# EAGLE schematic rbg3 (EAGLE 7.5.0)
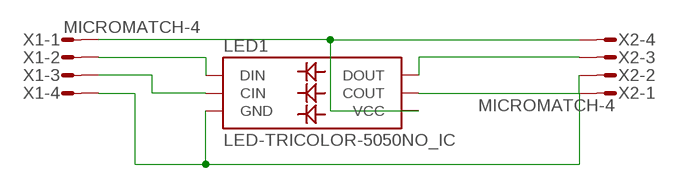
[diagram p0: schematic, sheet 1]

## Parts
LED1  LED-TRICOLOR-5050NO_IC  [LED-TRICOLOR-5050]
X1  MICROMATCH-4  [MICROMATCH-4]
X2  MICROMATCH-4  [MICROMATCH-4]

## Nets
N$1: LED1.4(VCC) X1.1 X2.4
N$2: LED1.1(DIN) X1.2
N$3: LED1.2(CIN) X1.3
N$4: LED1.3(GND) X1.4 X2.1
N$5: LED1.5(COUT) X2.2
N$6: LED1.6(DOUT) X2.3

## Library data of the parts
LED1 = SparkFun-LED:LED-TRICOLOR-5050
X1 X2 = con-amp-micromatch:MICROMATCH-4: MicroMaTch 4 7-215464-4 / 0-215464-4 Drawing Number C-215464 DDEController.pdf; MPN: 7-215464-4; OC_FARNELL: 3784629; OC_NEWARK: 19R8124